# Altium schematic sheet business card.schdoc
size 265 x 208 mm
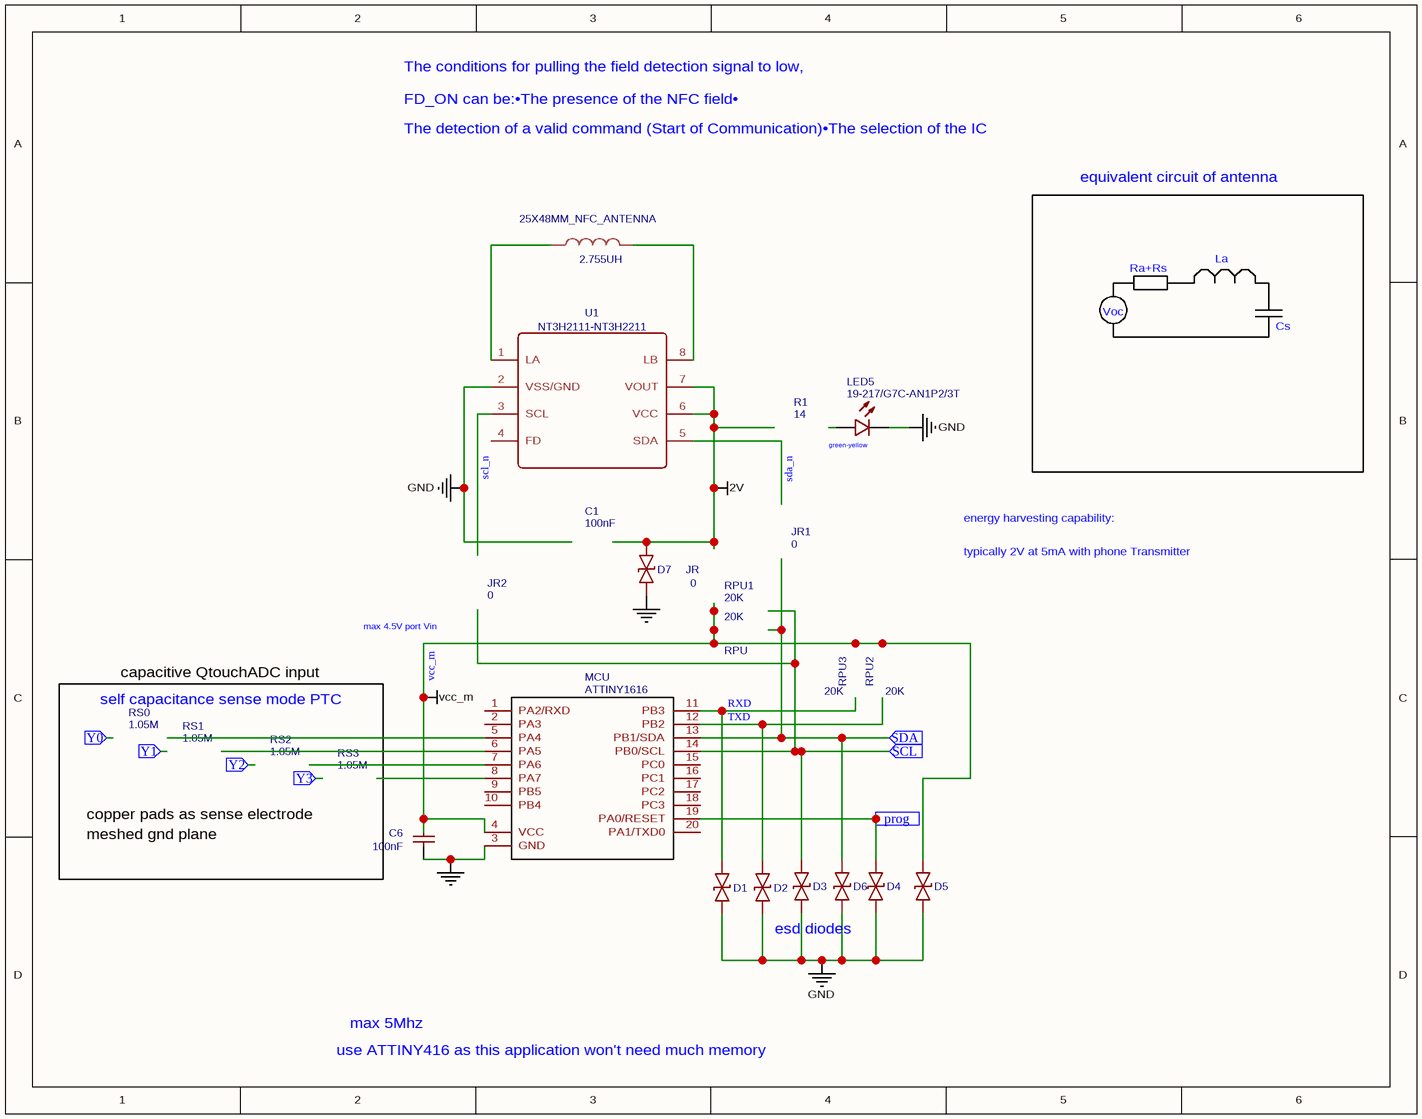
[diagram p0: business card.schdoc]

## Parts
2.755UH  25X48MM_NFC_ANTENNA  [25X48MM_NFC_ANTENNA]
C1  100nF  [0603]
C6  100nF  [0603_N]
D1  RCLAMP0521P-N  [X1-DFN1006-2_L1.0-W0.6-RD]  (value not drawn)
D2  RCLAMP0521P-N  [X1-DFN1006-2_L1.0-W0.6-RD]  (value not drawn)
D3  RCLAMP0521P-N  [X1-DFN1006-2_L1.0-W0.6-RD]  (value not drawn)
D4  RCLAMP0521P-N  [X1-DFN1006-2_L1.0-W0.6-RD]  (value not drawn)
D5  RCLAMP0521P-N  [X1-DFN1006-2_L1.0-W0.6-RD]  (value not drawn)
D6  RCLAMP0521P-N  [X1-DFN1006-2_L1.0-W0.6-RD]  (value not drawn)
D7  RCLAMP0521P-N  [X1-DFN1006-2_L1.0-W0.6-RD]  (value not drawn)
JR  0  [0603]
JR1  0  [0603]
JR2  0  [0603]
LED5  19-217/G7C-AN1P2/3T  [0603-LED]
MCU  ATTINY1616  [VQFN-20_3.3_0.45MM_PITCH_LONGER_PADS]
R1  14  [0603]
RPU  20K  [0603]
RPU1  20K  [0603]
RPU2  20K  [0603]
RPU3  20K  [0603]
RS0  1.05M  [0603]
RS1  1.05M  [0603]
RS2  1.05M  [0603]
RS3  1.05M  [0603]
U1  NT3H2111-NT3H2211  [SOIC-8_150MIL]

## Ports
prog (in), SCL (in), SDA (in), Y0 (in), Y1 (in), Y2 (in), Y3 (in)

## Nets
2V: D7.1 U1.6(VCC) U1.7(VOUT)
GND: C6.2 D1.2 D2.2 D3.2 D4.1 D5.1 D6.2 D7.2 LED5.MINUS(C) MCU.3(GND) U1.2(VSS/GND)
vcc_m: C6.1 D5.2 MCU.4(VCC)
prog: D4.2 MCU.19(PA0/RESET) ; port prog
RXD: D1.1 MCU.11(PB3)
SCL: D3.1 MCU.14(PB0/SCL) ; port SCL
scl_n: U1.3(SCL)
SDA: D6.1 MCU.13(PB1/SDA) ; port SDA
sda_n: U1.5(SDA)
TXD: D2.1 MCU.12(PB2)
Net2.755UH_P$1: 2.755UH.P$1 U1.8(LB)
Net2.755UH_P$2: 2.755UH.P$2 U1.1(LA)

Not connected (* = marked no-connect by the designer): LED5 PLUS(A); MCU 1(PA2/RXD) 2(PA3) 5(PA4) 6(PA5) 7(PA6) 8(PA7) 9(PB5) 10(PB4) 15(PC0) 16(PC1) 17(PC2) 18(PC3) 20(PA1/TXD0); U1 4(FD)

## Notes on the sheet
- The conditions for pulling the field detection signal to low,
- FD_ON can be:•The presence of the NFC field•
- The detection of a valid command (Start of Communication)•The selection of the IC
- equivalent circuit of antenna
- La
- Voc
- Ra+Rs
- Cs
- (near LED5) green-yellow
- energy harvesting capability:
- typically 2V at 5mA with phone Transmitter
- max 4.5V port Vin
- self capacitance sense mode PTC
- capacitive QtouchADC input
- copper pads as sense electrode
- meshed gnd plane
- esd diodes
- use ATTINY416 as this application won't need much memory
- max 5Mhz

## Library data of the parts
2.755UH = 25X48MM_NFC_ANTENNA: Contributor: ThijsH; spicePre: ?; spiceSymbolName: 25X48MM_NFC_ANTENNA
C1 = 100nF: BOM_Manufacturer Part: CL10B224KB8NNNC; BOM_Manufacturer: SAMSUNG; nameAlias: Capacitance; SMT Type: Extend; BOM_Supplier: LCSC; BOM_Supplier Part: C64705; BOM_LCSC Assembly: Yes; spicePre: C; spiceSymbolName: CL10B224KB8NNNC
C6 = 100nF: BOM_Manufacturer Part: CL10B104JB8NNNC; BOM_Manufacturer: SAMSUNG; nameAlias: Capacitance; SMT Type: Extend; BOM_Supplier: LCSC; BOM_Supplier Part: C24452; BOM_LCSC Assembly: Yes; spicePre: C; spiceSymbolName: CL10B104JB8NNNC
D1-D7 = RCLAMP0521P-N: BOM_Manufacturer: Bourne Semicon (Shenzhen); Contributor: LCSC; BOM_Supplier: LCSC; BOM_Supplier Part: C316043; BOM_Manufacturer Part: RCLAMP0521P-N; spicePre: D; spiceSymbolName: RCLAMP0521P-N
JR JR1 JR2 = 0: nameAlias: Value(Ω); spicePre: R; spiceSymbolName: Res_0805(1/8W)_EU
LED5 = 19-217/G7C-AN1P2/3T: BOM_Manufacturer: EVERLIGHT; SMT Type: Extend; BOM_Supplier: LCSC; BOM_Manufacturer Part: 19-217/G7C-AN1P2/3T; image: //image.lceda.cn/szlcsc/C72042.jpg; BOM_Supplier Part: C72042; BOM_LCSC Assembly: Yes; spicePre: L; spiceSymbolName: 19-217/G7C-AN1P2/3T
MCU = ATTINY1616: BOM_Manufacturer Part: ATTINY816-MFR; Contributor: akles98; BOM_Supplier Part: 2678820; BOM_Supplier: Element14; link: http://www.farnell.com/datasheets/2182719.pdf?_ga=2.181677927.1789737804.1494800456-984229216.1476205200; spicePre: U
R1 = 14: BOM_Manufacturer: UniOhm; BOM_Manufacturer Part: 0603WAF140JT5E; nameAlias: Resistance (Ohms); SMT Type: Extend; BOM_Supplier: LCSC; BOM_Supplier Part: C37078; BOM_LCSC Assembly: Yes; spicePre: R; spiceSymbolName: 0603WAF140JT5E
RPU RPU1-RPU3 = 20K: BOM_Manufacturer Part: TC0325B2002T5E; BOM_Manufacturer: UniOhm; nameAlias: Resistance (Ohms); SMT Type: Extend; BOM_Supplier: LCSC; BOM_Supplier Part: C53197; BOM_LCSC Assembly: Yes; spicePre: R; spiceSymbolName: TC0325B2002T5E
RS0-RS3 = 1.05M: BOM_Manufacturer: Uniroyal Elec; BOM_Manufacturer Part: 0603WAF1054T5E; nameAlias: Resistance (Ohms); Contributor: LCSC; SMT Type: Extend; BOM_Supplier: LCSC; BOM_Supplier Part: C247058; BOM_LCSC Assembly: Yes; spicePre: R; spiceSymbolName: 0603WAF1054T5E
U1 = NT3H2111-NT3H2211: BOM_Manufacturer: NXP; Contributor: SparkFun; BOM_SMT_Type: Extend; spicePre: U; spiceSymbolName: NT3H2111-NT3H2211